# Altium schematic sheet 蜂鸣器.SchDoc
size A4
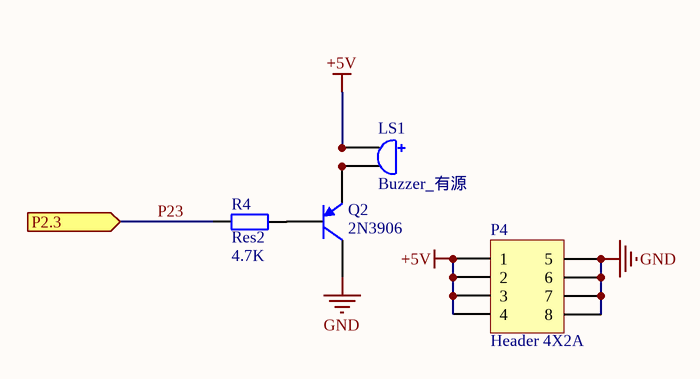
[diagram p0: 蜂鸣器.SchDoc]

## Parts
LS1  Buzzer_有源  [DIP6.6_2P]
P4  Header 4X2A  [HDR2X4_CEN]
Q2  2N3906  [TO-92A]
R4  Res2  value 4.7K  [AXIAL-0.4]

## Ports
P2.3 (in)

## Nets
+5V: LS1.1 P4.1 P4.2 P4.3 P4.4
GND: P4.5 P4.6 P4.7 P4.8 Q2.3(C)
P23: R4.1 ; port P2.3
NetLS1_2: LS1.2 Q2.1(E)
NetQ2_2: Q2.2(B) R4.2

## Notes on the sheet
- 专升本
- 通信工程
- 李烨攀
- 2101班
- 210806300163
- 学号

## Library data of the parts
P4 = Header 4X2A: Header, 4-Pin, Dual row; LatestRevisionDate: 17-Jul-2002; LatestRevisionNote: Re-released for DXP Platform.; Publisher: Altium Limited
Q2 = 2N3906: PNP General Purpose Amplifier; Published: 8-Jun-2000; LatestRevisionDate: 15-Jan-2003; LatestRevisionNote: PCB Footprint 'BCY-W3/D4.7' replaced; DatasheetVersion: 1997; PackageVersion: Sep-1998; PackageReference: TO-92A; Publisher: Altium Limited; PackageDescription: TO, Flat Index; 3 In-Line, Axial Leads; Body Dia. 4.5mm; Leads 0.51 x 0.48 mm (max); ComponentLink1Description: Manufacturer Link; ComponentLink1URL: http://www.fairchildsemi.com/; ComponentLink2Description: Datasheet; ComponentLink2URL: http://www.fairchildsemi.com/ds/2N%2F2N3906.pdf
R4 = Res2: Resistor; Published: 8-Jun-2000; LatestRevisionDate: 17-Jul-2002; LatestRevisionNote: Re-released for DXP Platform.; PackageReference: AXIAL-0.4; Publisher: Altium Limited; PackageDescription: Axial Device, Thru-Hole; 2 Leads; 0.4 in Pin Spacing